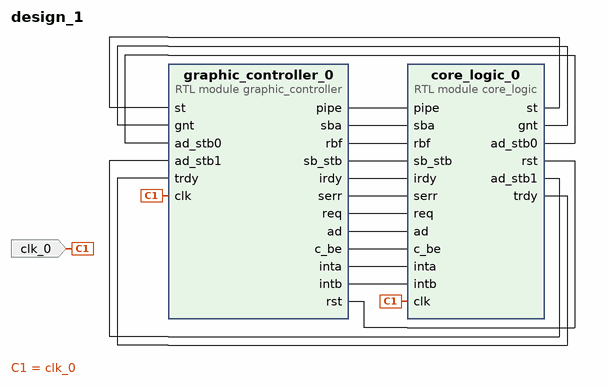
[diagram p0: block diagram of the top level]
# Vivado block design design_1, xc7a100tcsg324-1, Vivado 2020.1
create_bd_design design_1

create_bd_port -dir I -type clk clk_0

create_bd_cell -type module -reference core_logic core_logic_0
create_bd_cell -type module -reference graphic_controller graphic_controller_0

# ---- connections ----

connect_bd_net [get_bd_pins core_logic_0/st] [get_bd_pins graphic_controller_0/st]
connect_bd_net [get_bd_pins core_logic_0/gnt] [get_bd_pins graphic_controller_0/gnt]
connect_bd_net -net clk_0_1 [get_bd_ports clk_0] [get_bd_pins core_logic_0/clk] [get_bd_pins graphic_controller_0/clk]
connect_bd_net [get_bd_pins core_logic_0/ad_stb0] [get_bd_pins graphic_controller_0/ad_stb0]
connect_bd_net [get_bd_pins core_logic_0/ad_stb1] [get_bd_pins graphic_controller_0/ad_stb1]
connect_bd_net [get_bd_pins core_logic_0/trdy] [get_bd_pins graphic_controller_0/trdy]
connect_bd_net [get_bd_pins core_logic_0/rst] [get_bd_pins graphic_controller_0/rst]
connect_bd_net [get_bd_pins graphic_controller_0/pipe] [get_bd_pins core_logic_0/pipe]
connect_bd_net [get_bd_pins graphic_controller_0/sba] [get_bd_pins core_logic_0/sba]
connect_bd_net [get_bd_pins graphic_controller_0/rbf] [get_bd_pins core_logic_0/rbf]
connect_bd_net [get_bd_pins graphic_controller_0/sb_stb] [get_bd_pins core_logic_0/sb_stb]
connect_bd_net [get_bd_pins graphic_controller_0/irdy] [get_bd_pins core_logic_0/irdy]
connect_bd_net [get_bd_pins graphic_controller_0/serr] [get_bd_pins core_logic_0/serr]
connect_bd_net [get_bd_pins graphic_controller_0/req] [get_bd_pins core_logic_0/req]
connect_bd_net [get_bd_pins graphic_controller_0/ad] [get_bd_pins core_logic_0/ad]
connect_bd_net [get_bd_pins graphic_controller_0/c_be] [get_bd_pins core_logic_0/c_be]
connect_bd_net [get_bd_pins graphic_controller_0/inta] [get_bd_pins core_logic_0/inta]
connect_bd_net [get_bd_pins graphic_controller_0/intb] [get_bd_pins core_logic_0/intb]

validate_bd_design
save_bd_design
